# EAGLE design raspidolly (EAGLE 9.6.2)

## Sheet 1 of 2
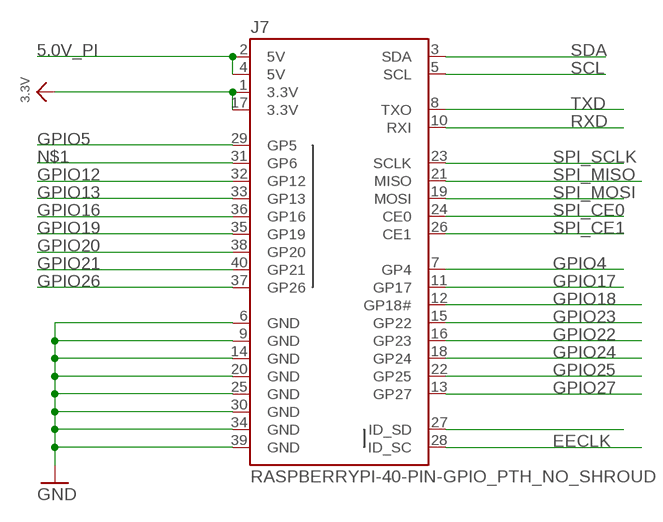
[diagram p0: schematic, sheet 1]

### Parts
J7  RASPBERRYPI-40-PIN-GPIO_PTH_NO_SHROUD  [2X20]

### Nets
3.3V: J7.1(3.3V) J7.17(3.3V) ; also sheet 2
5.0V_PI: J7.2(5V) J7.4(5V) ; also sheet 2
EECLK: J7.28(ID_SC)
EEDATA: J7.27(ID_SD)
GND: J7.6(GND) J7.9(GND) J7.14(GND) J7.20(GND) J7.25(GND) J7.30(GND) J7.34(GND) J7.39(GND) ; also sheet 2
GPIO4: J7.7(GP4) ; also sheet 2
GPIO5: J7.29(GP5)
GPIO12: J7.32(GP12) ; also sheet 2
GPIO13: J7.33(GP13) ; also sheet 2
GPIO16: J7.36(GP16) ; also sheet 2
GPIO17: J7.11(GP17) ; also sheet 2
GPIO18: J7.12(GP18#) ; also sheet 2
GPIO19: J7.35(GP19) ; also sheet 2
GPIO20: J7.38(GP20) ; also sheet 2
GPIO21: J7.40(GP21) ; also sheet 2
GPIO22: J7.15(GP22)
GPIO23: J7.16(GP23)
GPIO24: J7.18(GP24)
GPIO25: J7.22(GP25) ; also sheet 2
GPIO26: J7.37(GP26) ; also sheet 2
GPIO27: J7.13(GP27) ; also sheet 2
N$1: J7.31(GP6)
RXD: J7.10(RXI) ; also sheet 2
SCL: J7.5(SCL) ; also sheet 2
SDA: J7.3(SDA) ; also sheet 2
SPI_CE0: J7.24(CE0)
SPI_CE1: J7.26(CE1)
SPI_MISO: J7.21(MISO)
SPI_MOSI: J7.19(MOSI)
SPI_SCLK: J7.23(SCLK)
TXD: J7.8(TXO) ; also sheet 2

## Sheet 2 of 2: Systems
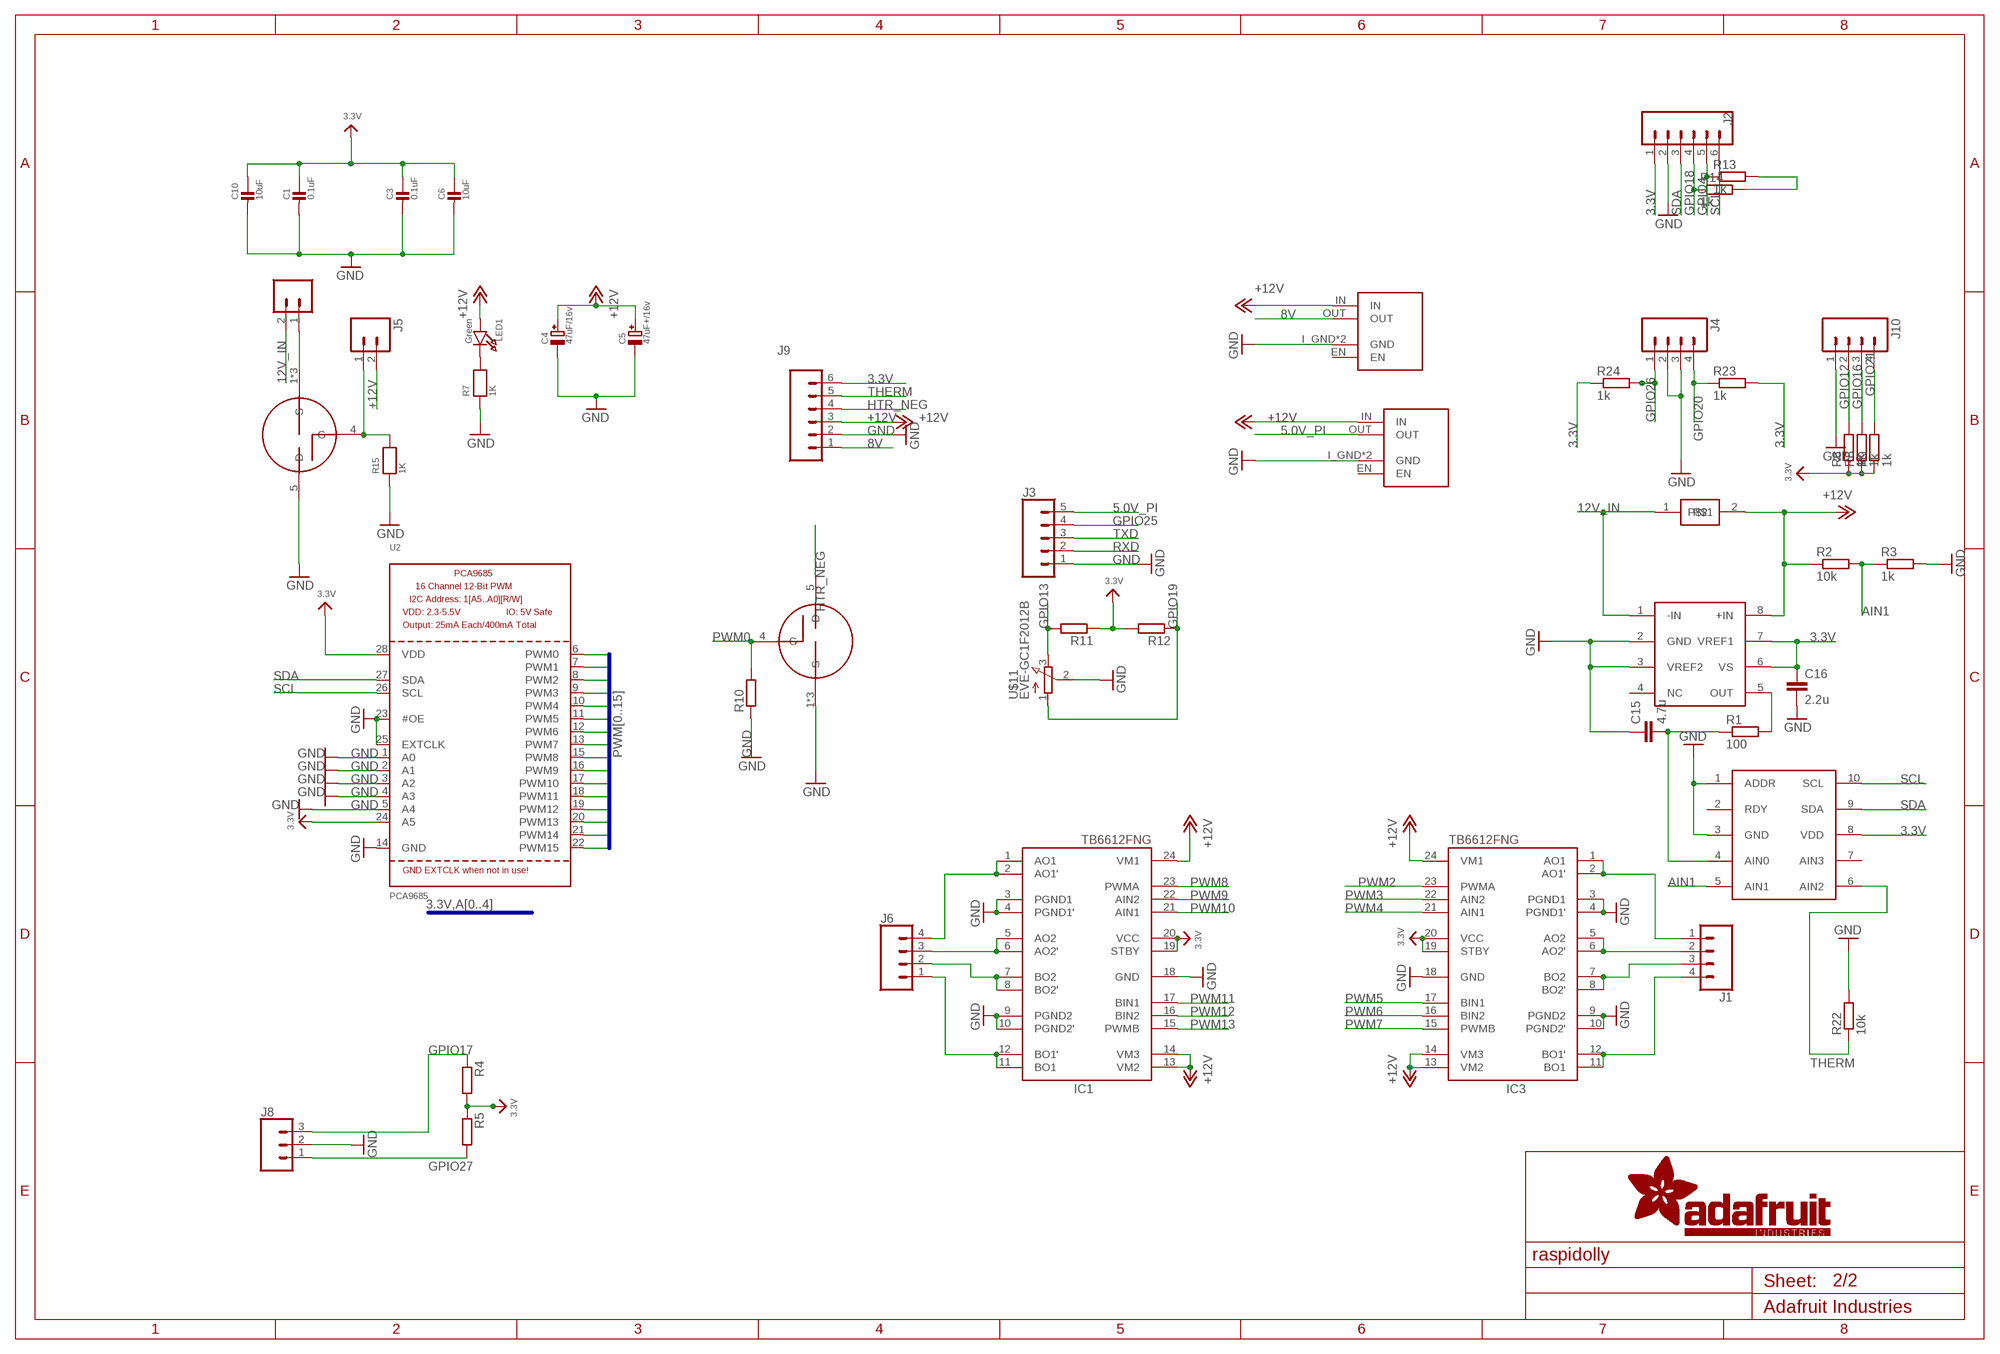
[diagram p1: schematic, sheet 2]

### Parts
C1  0.1uF  CAP_CERAMIC0805-NOOUTLINE  [0805-NO]
C3  0.1uF  CAP_CERAMIC0805-NOOUTLINE  [0805-NO]
C4  47uF/16v  CAP_ELECTROLYTICPANASONIC_C  [PANASONIC_C]
C5  47uF+/16v  CAP_ELECTROLYTICPANASONIC_C  [PANASONIC_C]
C6  10uF  CAP_CERAMIC0805-NOOUTLINE  [0805-NO]
C10  10uF  CAP_CERAMIC0805-NOOUTLINE  [0805-NO]
C15  4.7u  C-EUC0805  [C0805]
C16  2.2u  C-EUC0805  [C0805]
IC1  TB6612FNG  [SSOP24]
IC3  TB6612FNG  [SSOP24]
J1  CONN_04  [1X04]
J2  CONN_061.27MM  [1X06_1.27MM]
J3  CONN_051.27MM  [1X05_1.27MM]
J4  M04JST  [1X04-1.5MM_JST]
J5  M02PTH  [1X02]
J6  CONN_04  [1X04]
J8  CONN_03JST-PTH-VERT  [JST-3-PTH-VERT]
J9  CONN_061.27MM  [1X06_1.27MM]
J10  M04JST  [1X04-1.5MM_JST]
LED1  Green  LED0805_NOOUTLINE  [CHIPLED_0805_NOOUTLINE]
MPOWER  CONN_02  [1X02]
R1  100  R-EU_R0805  [R0805]
R2  10k  R-EU_R0805  [R0805]
R3  1k  R-EU_R0805  [R0805]
R4  R-EU_R0805  [R0805]
R5  R-EU_R0805  [R0805]
R6  1k  R-EU_R0805  [R0805]
R7  1K  RESISTOR0805_NOOUTLINE  [0805-NO]
R8  1k  R-EU_R0805  [R0805]
R9  1k  R-EU_R0805  [R0805]
R10  R-EU_R0805  [R0805]
R11  R-EU_R0805  [R0805]
R12  R-EU_R0805  [R0805]
R13  1k  R-EU_R0805  [R0805]
R14  1k  R-EU_R0805  [R0805]
R15  1K  RESISTOR0805_NOOUTLINE  [0805-NO]
R22  10k  R-EU_R0805  [R0805]
R23  1k  R-EU_R0805  [R0805]
R24  1k  R-EU_R0805  [R0805]
U2  PCA9685  [TSSOP28]
U$5  BUK9M  [LFPAK33]
U$6  BUK9M  [LFPAK33]
U$8  UFH-BUCK  [UFH-BUCK]
U$10  UFH-BUCK  [UFH-BUCK]
U$11  EVE-GC1F2012B  [EVE]
U$14  AD8418  [MSOP08]
U$15  ADS1015  [VSSOP10]
U$17  RESISTOR  [3921]

### Nets
3.3V: C1.1 C3.1 C6.1 C10.1 C16.1 IC1.19(STBY) IC1.20(VCC) IC3.19(STBY) IC3.20(VCC) J2.1 J9.6 R4.2 R5.1 R6.1 R8.1 R9.1 R11.1 R12.2 R13.2 R14.2 R23.2 R24.1 U2.24(A5) U2.28(VDD) U$14.6(VS) U$14.7(VREF1) U$15.8(VDD) ; also sheet 1
5.0V_PI: J3.5 U$10.OUT ; also sheet 1
8V: J9.1 U$8.OUT
12V_IN: MPOWER.2 U$14.1(-IN) U$17.1
+12V: C4.+ C5.+ IC1.13(VM2) IC1.14(VM3) IC1.24(VM1) IC3.13(VM2) IC3.14(VM3) IC3.24(VM1) J5.2 J9.3 LED1.A R2.1 U$8.IN U$10.IN U$14.8(+IN) U$17.2
AIN1: R2.2 R3.1 U$15.5(AIN1)
GND: C1.2 C3.2 C4.- C5.- C6.2 C10.2 C15.1 C16.2 IC1.3(PGND1) IC1.4(PGND1') IC1.9(PGND2) IC1.10(PGND2') IC1.18(GND) IC3.3(PGND1) IC3.4(PGND1') IC3.9(PGND2) IC3.10(PGND2') IC3.18(GND) J2.2 J3.1 J4.2 J4.3 J8.2 J9.2 J10.1 R3.2 R7.1 R10.1 R15.1 R22.2 U2.1(A0) U2.2(A1) U2.3(A2) U2.4(A3) U2.5(A4) U2.14(GND) U2.23(#OE) U2.25(EXTCLK) U$5.1(S) U$5.2(S) U$5.3(S) U$6.5(D) U$8.I_GND(GND) U$8.O_GND(GND) U$10.I_GND(GND) U$10.O_GND(GND) U$11.2(COM) U$14.2(GND) U$14.3(VREF2) U$15.1(ADDR) U$15.3(GND) ; also sheet 1
GPIO4: J2.5 R13.1 ; also sheet 1
GPIO12: J10.2 R6.2 ; also sheet 1
GPIO13: R11.2 U$11.3(B) ; also sheet 1
GPIO16: J10.3 R8.2 ; also sheet 1
GPIO17: J8.3 R4.1 ; also sheet 1
GPIO18: J2.4 R14.1 ; also sheet 1
GPIO19: R12.1 U$11.1(A) ; also sheet 1
GPIO20: J4.4 R23.1 ; also sheet 1
GPIO21: J10.4 R9.2 ; also sheet 1
GPIO25: J3.4 ; also sheet 1
GPIO26: J4.1 R24.2 ; also sheet 1
GPIO27: J8.1 R5.2 ; also sheet 1
HTR_NEG: J9.4 U$5.5(D)
N$3: MPOWER.1 U$6.1(S) U$6.2(S) U$6.3(S)
N$4: IC1.1(AO1) IC1.2(AO1') J6.4
N$6: IC1.5(AO2) IC1.6(AO2') J6.3
N$7: IC1.7(BO2) IC1.8(BO2') J6.2
N$9: IC1.11(BO1) IC1.12(BO1') J6.1
N$10: J5.1 R15.2 U$6.4(G)
N$12: IC3.1(AO1) IC3.2(AO1') J1.1
N$14: IC3.5(AO2) IC3.6(AO2') J1.2
N$15: IC3.7(BO2) IC3.8(BO2') J1.3
N$16: R1.2 U$14.5(OUT)
N$17: IC3.11(BO1) IC3.12(BO1') J1.4
N$20: C15.2 R1.1 U$15.4(AIN0)
N$133: LED1.C R7.2
PWM0: R10.2 U2.6(PWM0) U$5.4(G)
PWM1: U2.7(PWM1)
PWM2: IC3.23(PWMA) U2.8(PWM2)
PWM3: IC3.22(AIN2) U2.9(PWM3)
PWM4: IC3.21(AIN1) U2.10(PWM4)
PWM5: IC3.17(BIN1) U2.11(PWM5)
PWM6: IC3.16(BIN2) U2.12(PWM6)
PWM7: IC3.15(PWMB) U2.13(PWM7)
PWM8: IC1.23(PWMA) U2.15(PWM8)
PWM9: IC1.22(AIN2) U2.16(PWM9)
PWM10: IC1.21(AIN1) U2.17(PWM10)
PWM11: IC1.17(BIN1) U2.18(PWM11)
PWM12: IC1.16(BIN2) U2.19(PWM12)
PWM13: IC1.15(PWMB) U2.20(PWM13)
PWM14: U2.21(PWM14)
PWM15: U2.22(PWM15)
RXD: J3.2 ; also sheet 1
SCL: J2.6 U2.26(SCL) U$15.10(SCL) ; also sheet 1
SDA: J2.3 U2.27(SDA) U$15.9(SDA) ; also sheet 1
THERM: J9.5 R22.1 U$15.6(AIN2)
TXD: J3.3 ; also sheet 1
Unconnected: U$8.EN U$10.EN U$14.4(NC) U$15.2(RDY) U$15.7(AIN3)

### Buses
PWM[0..15]
3.3V,A[0..4]

## Library data of the parts
C1 C3 C6 C10 = microbuilder:CAP_CERAMIC: Ceramic Capacitors For new designs, use the packages preceded by an '_' character since they are more reliable: The following footprints should be used on most boards: _0402 - Standard footprint for regular board layouts _0603 - Standard footprint for regular board layouts _0805 - Standard footprint for regular board layouts For extremely tight-pitch boards where space is at a premium, the following 'micro-pitch' footprints can be used (smaller pads, no silkscreen outline, etc.): _0402MP - Micro-pitch footprint for very dense/compact boards _0603MP - Micro-pitch footprint for very dense/compact boards _0805MP - Micro-pitch footprint for very dense/compact boards Commonly Stocked Parts 0402 - 0402 Surface Mount Capacitors 16pF 50V 5% [Digikey: 445-4899-2-ND] 18pF 50V 5% [Digikey: 490-1281-2-ND] 22pF 50V 5% [Digikey: 490-1283-2-ND] 68pF 50V 5% [Digikey: 490-1289-2-ND] 0.1uF 10V 10% [Digikey: 490-1318-2-ND] 1.0uF 6.3V 10% [Digikey: 490-1320-2-ND] 0603 - 0603 Surface Mount Capacitors 16 pF 50V 5% [Digikey: 445-5051-2-ND] 22 pF 50V [Digikey: PCC220ACVTR-ND] 33 pF 50V 5% [Digikey: 490-1415-1-ND] 56pF 50V 5% [Digikey: 490-1421-1-ND] 220pF 50V 5% [Digikey: 445-1285-1-ND] 680 pF 50V 2200 pF 50V 5% C0G [Digikey: 445-1297-1-ND] 5600 pF 100V 5% X7R [Digikey: 478-3711-1-ND] 0.1 µF 25V 10% [Digikey: PCC2277TR-ND] 0.22 µF 16V 10% X7R [Digikey: 445-1318-1-ND] 1.0 µF 25V 10% [Digikey: 445-5146-2-ND] 0603 - RF Specific 3pF 250V +/-0.1pF RF [Digikey: 712-1347-1-ND] 18 pF 250V 5% [Digikey: 478-3505-1-ND or 712-1322-1-ND] 56 pF 250V 5% C0G RF [Digikey: 490-4867-1-ND] 68 pF 250V RF [Digikey: 490-4868-1-ND] 0805 - 0805 Surface Mount Capacitors 220 pF 250V 2% RF Ceramic Capacitor [Digikey: 712-1398-1-ND] 1000 pF 50V 2% NP0 Ceramic Capacitor [Digikey: 478-3760-1-ND] 0.1 µF 25V 10% Ceramic Capacitor [Digikey: PCC1828TR-ND] 1.0 µF 16V 10% Ceramic Capacitor[Digikey: 490-1691-2-ND] 10.0 µF 10V 10% Ceramic Capacitor[Digikey: 709-1228-1-ND] 10.0 uF 16V 10% Ceramic Capacitor [Digikey: 478-5165-2-ND] 47 uF 6.3V 20% Ceramic Capacitor [Digikey: 587-1779-1-ND or 399-5506-1-ND] 1206 - 1206 Surface Mount Capacitors 47uF 10V 20% Ceramic Capacitor [Digikey: 490-5528-1-ND or 399-5508-1-ND or 445-6010-1-ND] 100uF 6.3V -20%, +80% Y5V Ceramic Capacitor (Digikey: 490-4512-1-ND, Mouser: 81-GRM31CF50J107ZE1L)
C4 C5 = microbuilder:CAP_ELECTROLYTIC: Electrolytic Capacitors SMT PANASONIC_C - Size C Panasonic Electrolytic Aluminum Capacitor 47µF 16V 20% Electrolytic Capacitor [Digikey: PCE3890TR-ND] PANASONIC_D - Size D Panasonic Electrolytic Aluminum Capacitor 100µF 25V 20% Electrolytic Capacitor [Digikey: PCE3898TR-ND] PTH 3.5 mm grid, 8 mm diameter ... 3.5 mm grid, 10 mm diameter ...
C15 C16 = rcl:C-EU: CAPACITOR, European symbol; SPICEPREFIX: C
IC1 IC3 = adafruit:TB6612FNG: TB6612FNG MOS dual H-bridge motor driver, 1.2A current 3.2A peak 3 or 5v logic and 3-15v motor
J1 J6 = SparkFun-Connectors:CONN_04: Multi connection point. Often used as Generic Header-pin footprint for 0.1 inch spaced/style header connections On any of the 0.1 inch spaced packages, you can populate with these: Break Away Headers - Straight <https://www.sparkfun.com/products/116> (PRT-00116) Break Away Male Headers - Right Angle <https://www.sparkfun.com/products/553> (PRT-00553) Female Headers <https://www.sparkfun.com/products/115> (PRT-00115) Break Away Headers - Machine Pin <https://www.sparkfun.com/products/117> (PRT-00117) Break Away Female Headers - Swiss Machine Pin <https://www.sparkfun.com/products/743> (PRT-00743) For SCREWTERMINALS and SPRING TERMINALS visit here: Screw Terimnals on SparkFun.com <https://www.sparkfun.com/search/results?term=Screw+Terminals> (5mm/3.5mm/2.54mm spacing) This device is also useful as a general connection point to wire up your design to another part of your project. Our various solder wires solder well into these plated through hole pads. Hook-Up Wire - Assortment (Stranded, 22 AWG) <https://www.sparkfun.com/products/11375> (PRT-11375) Hook-Up Wire - Assortment (Solid Core, 22 AWG) <https://www.sparkfun.com/products/11367> (PRT-11367) View the entire wire category on our website here <https://www.sparkfun.com/categories/141> Special notes: Molex polarized connector foot print use with SKU : PRT-08231 with associated crimp pins and housings. 1MM SMD Version SKU: PRT-10208; PROD_ID: CONN-09696
J2 J9 = SparkFun-Connectors:CONN_06: Multi connection point. Often used as Generic Header-pin footprint for 0.1 inch spaced/style header connections On any of the 0.1 inch spaced packages, you can populate with these: Break Away Headers - Straight <https://www.sparkfun.com/products/116> (PRT-00116) Break Away Male Headers - Right Angle <https://www.sparkfun.com/products/553> (PRT-00553) Female Headers <https://www.sparkfun.com/products/115> (PRT-00115) Break Away Headers - Machine Pin <https://www.sparkfun.com/products/117> (PRT-00117) Break Away Female Headers - Swiss Machine Pin <https://www.sparkfun.com/products/743> (PRT-00743) Arduino Stackable Header - 6 Pin <https://www.sparkfun.com/products/9280> (PRT-09280) For SCREWTERMINALS and SPRING TERMINALS visit here: Screw Terimnals on SparkFun.com <https://www.sparkfun.com/search/results?term=Screw+Terminals> (5mm/3.5mm/2.54mm spacing) This device is also useful as a general connection point to wire up your design to another part of your project. Our various solder wires solder well into these plated through hole pads. Hook-Up Wire - Assortment (Stranded, 22 AWG) <https://www.sparkfun.com/products/11375> (PRT-11375) Hook-Up Wire - Assortment (Solid Core, 22 AWG) <https://www.sparkfun.com/products/11367> (PRT-11367) View the entire wire category on our website here <https://www.sparkfun.com/categories/141>
J3 = SparkFun-Connectors:CONN_05: Multi connection point. Often used as Generic Header-pin footprint for 0.1 inch spaced/style header connections On any of the 0.1 inch spaced packages, you can populate with these: Break Away Headers - Straight <https://www.sparkfun.com/products/116> (PRT-00116) Break Away Male Headers - Right Angle <https://www.sparkfun.com/products/553> (PRT-00553) Female Headers <https://www.sparkfun.com/products/115> (PRT-00115) Break Away Headers - Machine Pin <https://www.sparkfun.com/products/117> (PRT-00117) Break Away Female Headers - Swiss Machine Pin <https://www.sparkfun.com/products/743> (PRT-00743) For SCREWTERMINALS and SPRING TERMINALS visit here: Screw Terimnals on SparkFun.com <https://www.sparkfun.com/search/results?term=Screw+Terminals> (5mm/3.5mm/2.54mm spacing) This device is also useful as a general connection point to wire up your design to another part of your project. Our various solder wires solder well into these plated through hole pads. Hook-Up Wire - Assortment (Stranded, 22 AWG) <https://www.sparkfun.com/products/11375> (PRT-11375) Hook-Up Wire - Assortment (Solid Core, 22 AWG) <https://www.sparkfun.com/products/11367> (PRT-11367) View the entire wire category on our website here <https://www.sparkfun.com/categories/141> Special notes: Molex polarized connector foot print use with SKU : PRT-08231 with associated crimp pins and housings. 1MM SMD Version SKU: PRT-10208
J4 J10 = SparkFun-Connectors:M04: Header 4 Standard 4-pin 0.1" header. Use with straight break away headers (SKU : PRT-00116), right angle break away headers (PRT-00553), swiss pins (PRT-00743), machine pins (PRT-00117), and female headers (PRT-00115). Molex polarized connector foot print use with SKU : PRT-08231 with associated crimp pins and housings. 1MM SMD Version SKU: PRT-10208; PROD_ID: CONN-12477
J5 = SparkFun-Connectors:M02: Standard 2-pin 0.1" header. Use with - straight break away headers ( PRT-00116) - right angle break away headers (PRT-00553) - swiss pins (PRT-00743) - machine pins (PRT-00117) - female headers (PRT-00115) Molex polarized connector foot print use with: PRT-08233 with associated crimp pins and housings. 2.54_SCREWTERM for use with PRT-10571. 3.5mm Screw Terminal footprints for PRT-08084 5mm Screw Terminal footprints for use with PRT-08432
J7 = SparkFun-Connectors:RASPBERRYPI-40-PIN-GPIO: Raspberry Pi GPIO Header 2x20 pin connector, as found on B, B+, A+ models. Both shrouded PTH and SMT versions available. SparkFun Products: GPIO Shrouded Header <https://www.sparkfun.com/products/13054>- PTH SparkFun Pi Wedge (Preassembled) <https://www.sparkfun.com/products/13717>
J8 = SparkFun-Connectors:CONN_03: Multi connection point. Often used as Generic Header-pin footprint for 0.1 inch spaced/style header connections On any of the 0.1 inch spaced packages, you can populate with these: Break Away Headers - Straight <https://www.sparkfun.com/products/116> (PRT-00116) Break Away Male Headers - Right Angle <https://www.sparkfun.com/products/553> (PRT-00553) Female Headers <https://www.sparkfun.com/products/115> (PRT-00115) Break Away Headers - Machine Pin <https://www.sparkfun.com/products/117> (PRT-00117) Break Away Female Headers - Swiss Machine Pin <https://www.sparkfun.com/products/743> (PRT-00743) Stackable Header - 3 Pin (Female, 0.1") <https://www.sparkfun.com/products/13875> (PRT-13875) For SCREWTERMINALS and SPRING TERMINALS visit here: Screw Terimnals on SparkFun.com <https://www.sparkfun.com/search/results?term=Screw+Terminals> (5mm/3.5mm/2.54mm spacing) This device is also useful as a general connection point to wire up your design to another part of your project. Our various solder wires solder well into these plated through hole pads. Hook-Up Wire - Assortment (Stranded, 22 AWG) <https://www.sparkfun.com/products/11375> (PRT-11375) Hook-Up Wire - Assortment (Solid Core, 22 AWG) <https://www.sparkfun.com/products/11367> (PRT-11367) View the entire wire category on our website here <https://www.sparkfun.com/categories/141> Special notes: Molex polarized connector foot print use with SKU : PRT-08232 with associated crimp pins and housings.; PROD_ID: CONN-13230
LED1 = microbuilder:LED: LED 0603 - 0603 Surface Mount Package 2mA: Green LED - Low Power (3.9mcd, 2ma, 1.7Vf) - Digikey: 475-2709-2-ND Orange LED - Low Power (9.8mcd, 2ma, 1.8Vf) - Digikey: 475-1194-2-ND Red LED - Low Power (5mcd, 2ma, 1.8Vf) - Digikey: 475-1195-2-ND Yellow LED - Low Power (7mcd, 2ma, 1.8Vf) - Digikey: 475-1196-2-ND 5mA: Blue LED - Low Power (17mcd, 5ma, 2.9Vf) - Digikey: LNJ937W8CRACT-ND 0805 - 0805 Surface Mount Package 2mA: Red LED (8.8mcd, 2mA, 1.8Vf, Clear) - Low Power [Digikey: 475-2510-1-ND] Green LED (5mcd, 2mA, 1.8Vf, Clear) - Low Power [Digikey: 475-2730-1-ND] Yellow LED (11.3mcd, 2mA, 1.8Vf, Clear) - Low Power [Digikey: 475-2555-1-ND] 20mA: Red LED (104mcd, 20mA, Diffused) - LS R976 [Digikey: 475-1278-6-ND] Red LED (12mcd, 20mA, 2.0Vf, Clear) - APT2012EC [Digikey: 754-1128-1-ND] Green LED (15mcd, 20mA, 2.2Vf, Clear) - APT2012GC [Digikey: 754-1131-1-ND] Orange LED (160mcd, 20mA, 2.1Vf, Clear) - APT2012SECK [Digikey: 754-1130-1-ND] 1206 - 1206 Surface Mount Package Green LED (26mcd, 20mA, Diffused) - LG N971 [Digikey: 475-1407-6-ND] Red LED (15mcd, 20mA, Diffused) - LH N974 [Digikey: 475-1416-6-ND] Cree - Cree High-Power Surface Mount LEDs XPEBWT-L1-0000-00D50 - White 111lm 350mA 2.9Vf 6200K 110° XTEAWT-00-0000-00000LEE3 - White 114lm 350mA 2.85Vf 5000K 115° Everlight - Everlight 45-21 Series Surface Mount LEDs 45-21/QK2C-B2832AC2CB2/2T - Warm White 2000mcd 20mA 3.25Vf 3050K 120° 45-21/LK2C-B38452C4CB2/2T - Nuetral White 2000mcd 20mA 3.25Vf 4150K 120° 45-21/LK2C-B50634C6CB2/2T - Cold White 2200mcd 20mA 3.25Vf 5650K 120° PLCC2 Reverse Mount LS T77K-J1L2-1-0-2-R18-Z - Red 11.25mcd 2mA 1.8Vf 630nm 120° LO T77K-L1M2-24-Z - Orange 19.6mcd 2mA 1.8Vf 606nm 120° LY T77K-K2M1-26-Z - Yellow 15.7mcd 2mA 1.8Vf 587nm 120°
MPOWER = SparkFun-Connectors:CONN_02: Multi connection point. Often used as Generic Header-pin footprint for 0.1 inch spaced/style header connections On any of the 0.1 inch spaced packages, you can populate with these: Break Away Headers - Straight <https://www.sparkfun.com/products/116> (PRT-00116) Break Away Male Headers - Right Angle <https://www.sparkfun.com/products/553> (PRT-00553) Female Headers <https://www.sparkfun.com/products/115> (PRT-00115) Break Away Headers - Machine Pin <https://www.sparkfun.com/products/117> (PRT-00117) Break Away Female Headers - Swiss Machine Pin <https://www.sparkfun.com/products/743> (PRT-00743) For SCREWTERMINALS and SPRING TERMINALS visit here: Screw Terimnals on SparkFun.com <https://www.sparkfun.com/search/results?term=Screw+Terminals> (5mm/3.5mm/2.54mm spacing) This device is also useful as a general connection point to wire up your design to another part of your project. Our various solder wires solder well into these plated through hole pads. Hook-Up Wire - Assortment (Stranded, 22 AWG) <https://www.sparkfun.com/products/11375> (PRT-11375) Hook-Up Wire - Assortment (Solid Core, 22 AWG) <https://www.sparkfun.com/products/11367> (PRT-11367) View the entire wire category on our website here <https://www.sparkfun.com/categories/141> Special notes: Molex polarized connector foot print use with: PRT-08233 with associated crimp pins and housings. 2.54_SCREWTERM for use with PRT-10571. 3.5mm Screw Terminal footprints for PRT-08084 5mm Screw Terminal footprints for use with PRT-08432
R1-R3 R6 R8 R9 R13 R14 R22-R24 = rcl:R-EU_: RESISTOR, European symbol; SPICEPREFIX: R
R4 R5 R10-R12 = resistor:R-EU_: RESISTOR, European symbol
R7 R15 = microbuilder:RESISTOR: Resistors For new designs, use the packages preceded by an '_' character since they are more reliable: The following footprints should be used on most boards: _0402 - Standard footprint for regular board layouts _0603 - Standard footprint for regular board layouts _0805 - Standard footprint for regular board layouts For extremely tight-pitch boards where space is at a premium, the following 'micro-pitch' footprints can be used (smaller pads, no silkscreen outline, etc.): _0402MP - Micro-pitch footprint for very dense/compact boards _0603MP - Micro-pitch footprint for very dense/compact boards _0805MP - Micro-pitch footprint for very dense/compact boards
U2 = microbuilder:PCA9685: PCA9685 - 16 Channel 12-Bit I2C PWM Controller 5.0V tolerant 16 channel, 12-bit I2C PWM controller with 25mA per output (max. 400mA total) Digikey: 568-5931-1-ND
U$5 U$6 = abysscore:BUK9M
U$8 U$10 = abysscore:UFH-BUCK
U$11 = abysscore:EVE-GC1F2012B
U$14 = abysscore:AD8418
U$15 = abysscore:ADS1015
U$17 = abysscore:RESISTOR

## Board
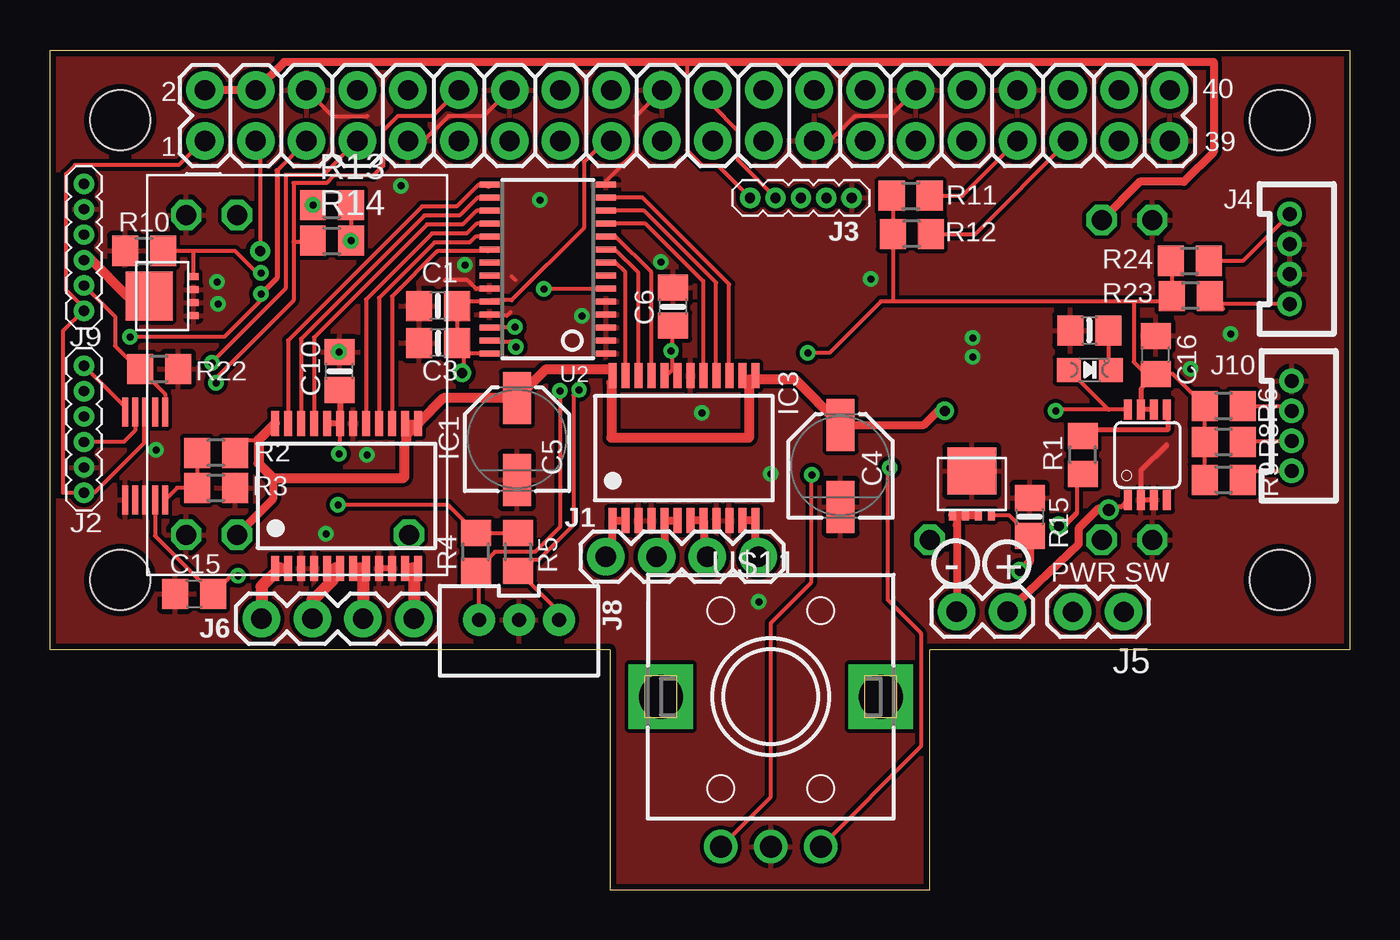
[diagram p2: board, top side]
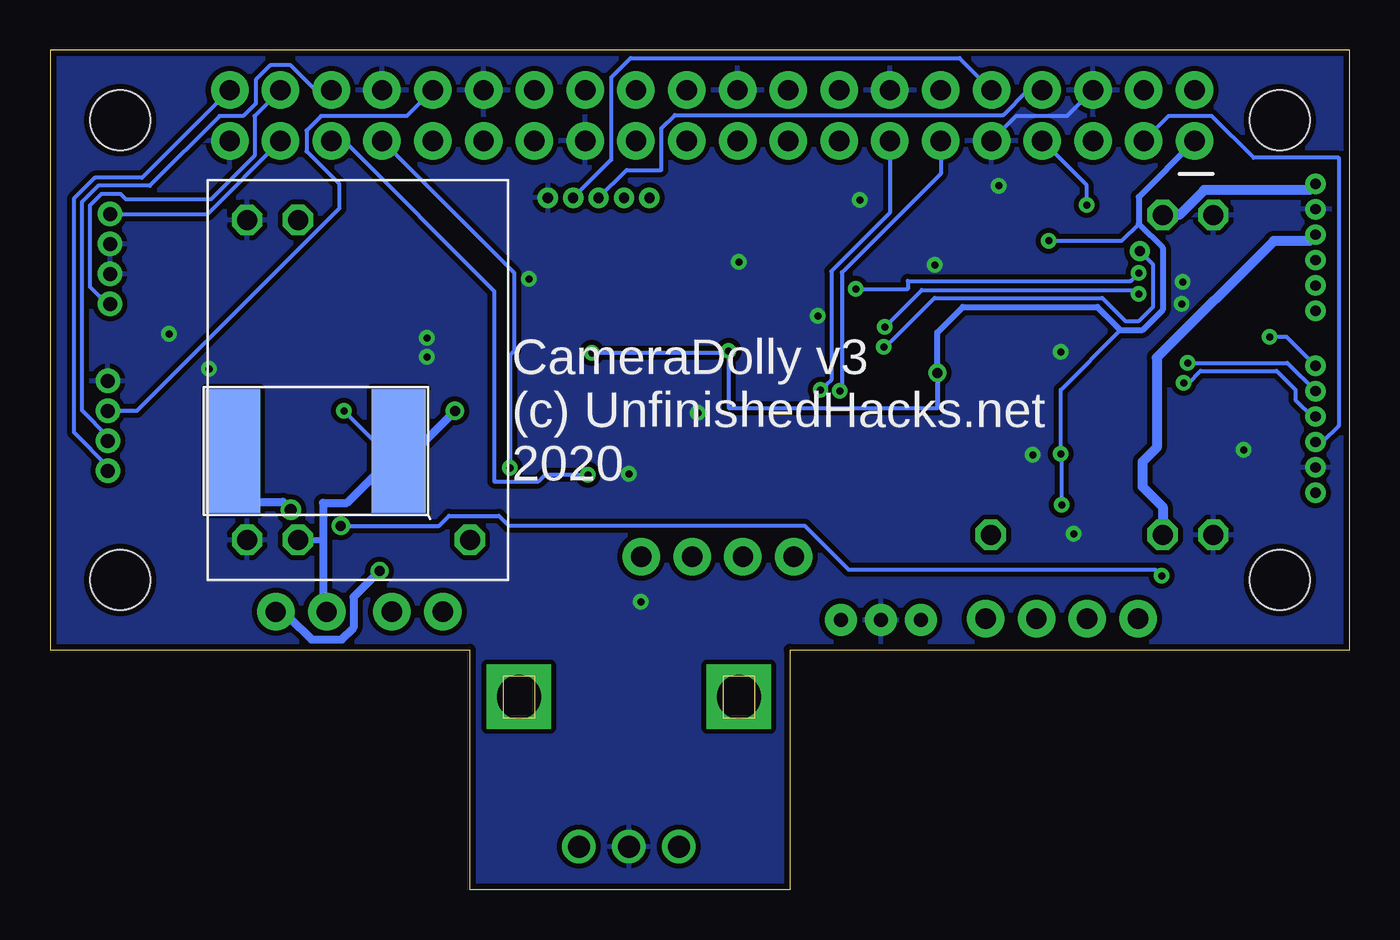
[diagram p3: board, bottom side, seen from below]

Size 65 x 42 mm. Coordinates in mm from the lower left corner, seen from the top.
Outline: 0,42 65,42 65,12 44,12 44,0 28,0 28,12 0,12 0,42
Copper layers (1*16): Top 0.035mm / dielectric 1.5mm / Bottom 0.035mm
Design rules "adafruit *": minimum track width 0.2mm, minimum drill 0.3mm, track to track 8mil, track to pad 0.2mm, pad to pad 0.2mm, via to via 8mil, smd to smd 0.2mm, copper to edge 0.3mm, drill to drill 0.3mm, minimum pad ring 10mil, minimum via ring 8mil, stop-mask expansion 2mil, vias tented up to drill 20mil, thermal gap 10mil
Holes 3 mm at 3.5,15.5 61.5,15.5 61.5,38.5 3.5,38.5

### Footprints (pad centres in the part's own frame; a part is rotated, then mirrored left to right if it is on the bottom)
0805-NO = smd 1.3 x 1.5: 1 -0.95,0; 2 0.95,0
PANASONIC_C = smd 2.6 x 1.4: + 2.05,0; - -2.05,0
C0805 = smd 1.3 x 1.5: 1 -0.95,0; 2 0.95,0
SSOP24 = smd 0.4 x 1.25: 1 -3.575,-3.625; 2 -2.925,-3.625; 3 -2.275,-3.625; 4 -1.625,-3.625; 5 -0.975,-3.625; 6 -0.325,-3.625; 7 0.325,-3.625; 8 0.975,-3.625; 9 1.625,-3.625; 10 2.275,-3.625; 11 2.925,-3.625; 12 3.575,-3.625; 13 3.575,3.625; 14 2.925,3.625; 15 2.275,3.625; 16 1.625,3.625; 17 0.975,3.625; 18 0.325,3.625; 19 -0.325,3.625; 20 -0.975,3.625; 21 -1.625,3.625; 22 -2.275,3.625; 23 -2.925,3.625; 24 -3.575,3.625
1X04 = drill 1.016 pad 1.88: 1 0,0; 2 2.54,0; 3 5.08,0; 4 7.62,0
1X06_1.27MM = drill 0.508 pad 1: 1 0,0; 2 1.27,0; 3 2.54,0; 4 3.81,0; 5 5.08,0; 6 6.35,0
1X05_1.27MM = drill 0.508 pad 1: 1 0,0; 2 1.27,0; 3 2.54,0; 4 3.81,0; 5 5.08,0
1X04-1.5MM_JST = drill 0.7: 1 0,0; 2 1.5,0; 3 3,0; 4 4.5,0
1X02 = drill 1 pad 1.88: 1 0,0; 2 2.54,0
2X20 = drill 1.016 pad 1.88: 1 0,0; 2 0,2.54; 3 2.54,0; 4 2.54,2.54; 5 5.08,0; 6 5.08,2.54; 7 7.62,0; 8 7.62,2.54; 9 10.16,0; 10 10.16,2.54; 11 12.7,0; 12 12.7,2.54; 13 15.24,0; 14 15.24,2.54; 15 17.78,0; 16 17.78,2.54; 17 20.32,0; 18 20.32,2.54; 19 22.86,0; 20 22.86,2.54; 21 25.4,0; 22 25.4,2.54; 23 27.94,0; 24 27.94,2.54; 25 30.48,0; 26 30.48,2.54; 27 33.02,0; 28 33.02,2.54; 29 35.56,0; 30 35.56,2.54; 31 38.1,0; 32 38.1,2.54; 33 40.64,0; 34 40.64,2.54; 35 43.18,0; 36 43.18,2.54; 37 45.72,0; 38 45.72,2.54; 39 48.26,0; 40 48.26,2.54
JST-3-PTH-VERT = drill 0.7 pad 1.6: 1 -2,-0.55; 2 0,-0.55; 3 2,-0.55
CHIPLED_0805_NOOUTLINE = smd 1.2 x 1.2: A 0,-1.05; C 0,1.05
1X02' = drill 1.016 pad 1.88: 1 0,0; 2 2.54,0
R0805 = smd 1.3 x 1.5: 1 -0.95,0; 2 0.95,0
TSSOP28 = smd 0.305 x 0.991: 1 -4.225,-2.918; 2 -3.575,-2.918; 3 -2.925,-2.918; 4 -2.275,-2.918; 5 -1.625,-2.918; 6 -0.975,-2.918; 7 -0.325,-2.918; 8 0.325,-2.918; 9 0.975,-2.918; 10 1.625,-2.918; 11 2.275,-2.918; 12 2.925,-2.918; 13 3.575,-2.918; 14 4.225,-2.918; 15 4.225,2.918; 16 3.575,2.918; 17 2.925,2.918; 18 2.275,2.918; 19 1.625,2.918; 20 0.975,2.918; 21 0.325,2.918; 22 -0.325,2.918; 23 -0.975,2.918; 24 -1.625,2.918; 25 -2.275,2.918; 26 -2.925,2.918; 27 -3.575,2.918; 28 -4.225,2.918
LFPAK33 = smd 0.35 x 0.5: 1 -0.975,-0.775; 2 -0.325,-0.775; 3 0.325,-0.775; 4 0.975,-0.775 | smd 2.45 x 2.35: 5 0,1.45
UFH-BUCK = drill 1 octagon: EN 18,13.1; I_GND 18,1.96; IN 18,4.5; O_GND 2,1.96; OUT 2,4.5
EVE = drill 1.1 pad 1.676: 1 -2.5,-7.5; 2 0,-7.5; 3 2.5,-7.5 | drill 2.2 pad 2.8 square: M1 5.5,0; M2 -5.5,0
MSOP08 = smd 0.4 x 1: 1 -0.976,-2.263; 2 -0.326,-2.263; 3 0.324,-2.263; 4 0.974,-2.263; 5 0.974,2.262; 6 0.324,2.262; 7 -0.326,2.262; 8 -0.976,2.262
VSSOP10 = smd 1.45 x 0.3: 1 -2.2,1; 2 -2.2,0.5; 3 -2.2,0; 4 -2.2,-0.5; 5 -2.2,-1; 6 2.2,-1; 7 2.2,-0.5; 8 2.2,0; 9 2.2,0.5; 10 2.2,1
3921 = smd 2.7 x 6.2: 1 -4.15,0; 2 4.15,0

### Placement (x,y rotation side)
C1  19.41,29.2 180 top
C3  19.42,27.34 180 top
C4  39.55,21.2 90 top
C5  23.36,22.53 90 top
C6  31.17,29.15 90 top
C10  14.48,25.93 90 top
C15  7.2,14.8 0 top
C16  55.3,26.75 90 top
IC1  14.84,19.7 0 top
IC3  31.7,22.08 0 top
J1  27.8,16.65 0 top
J2  1.7,19.85 90 top
J3  40.1,34.6 180 top
J4  62,33.8 270 top
J5  53.7,13.9 180 top
J6  18.2,13.55 180 top
J7  7.75,37.45 0 top
J8  23.45,12.95 180 top
J9  1.7,35.3 270 top
J10  62.1,25.45 270 top
LED1  52,26 270 top
MPOWER  [1X02']  45.35,13.9 0 top
R1  51.65,21.75 90 top
R2  8.3,21.85 180 top
R3  8.3,20.1 0 top
R4  21.3,16.9 90 top
R5  23.4,16.9 270 top
R6  58.7,24.2 0 top
R7  51.99,27.97 0 top
R8  58.7,22.4 0 top
R9  58.7,20.5 0 top
R10  4.7,31.95 0 top
R11  43.05,34.7 0 top
R12  43.1,32.8 180 top
R13  14.1,34.25 0 top
R14  14.1,32.45 0 top
R15  49,18.65 270 top
R22  5.45,26.05 0 top
R23  57.05,29.7 180 top
R24  57,31.45 0 top
U2  24.9,31.04 90 top
U$5  6.4,29.7 90 top
U$6  46.1,19.5 0 top
U$8  4.85,35.75 270 top
U$10  57.1,35.5 270 bottom
U$11  36.05,9.65 0 top
U$14  54.9,21.75 0 top
U$15  4.75,21.7 90 top
U$17  51.7,21.95 0 bottom

### Tracks (layer width: path | path; a pad name or v marks a point on that pad's centre or on a via)
3.3V  (via drill 0.35, 0.5)
  Top 0.2: C3.1 20.36,27.36 C1.1 20.57,29.41 U2.24 22.06,29.48 23.09,29.48 26.7,33.09 26.7,36.4 27.75,37.45 J7.17 | U2.28 20.9,26.81 C3.1 | C3.1 20.69,27.02 20.69,25.93 v20.62,25.85 | 31.12,26 31.12,26.88 v31.06,26.95 31.13,27.02 31.13,28.16 C6.1 | J7.1 7.64,37.45 6.44,36.25 1.25,36.25 0.8,35.8 0.8,29.98 1.7,29.08 1.7,29 | 54.2,29.42 54.2,26.4 54.8,25.8 C16.1 | 54.57,25.05 54.7,25.18 54.7,25.2 C16.1 | R24.1 56.1,31.4 R23.2 56.1,29.42 54.2,29.42 | 54.2,29.42 42.1,29.42 | 42.1,29.42 41.55,29.42 38.98,26.85 v37.9,26.85 | R11.1 42.15,34.65 R12.2 42.15,29.47 42.1,29.42 | J9.6 1.7,29 | 1.7,29 0.65,27.95 0.65,19.85 J2.1 2.22,19.85 4.7,22.33 4.7,23.85 U$15.8 | IC3.20 30.82,25.7 31.12,26 | IC3.19 31.38,25.75 31.12,26 | C10.1 14.48,21.78 14.45,21.75 v14.45,21.8 | R5.1 R4.2 19.9,19.25 v14.4,19.25 | R9.1 R8.1 R6.1 56.15,25.8 C16.1 | R13.2 R14.2
  Top 0.25: 54.57,25.05 U$14.7 U$14.6 | C16.1 54.85,25.35
  Top 0.3: IC1.19 IC1.20
  Top 0.305: C10.1 14.51,24.95 IC1.19
  Bottom 0.2: 20.62,24.09 31.06,24.09 v31.06,26.95 31.16,26.85 v37.9,26.85 | 11.45,27.99 14.45,24.99 v14.45,21.8 14.4,21.75 v14.4,19.25 | R14.2 11.4,32.45 10.55,33.3
  Bottom 0.25: v20.62,25.85 20.62,24.09
  Bottom 0.3: J7.1 10.55,34.65 10.55,33.3 9.35,32.1 9.35,28.99 10.35,27.99 11.45,27.99 12.6,29.14 19.35,29.14 20.62,27.87 v20.62,25.85 20.64,25.85 20.65,25.84
  other vias: 15.05,32.45
5.0V_PI
  Top 0.2: J3.5 33.41,36.21 32.64,36.21 31.85,37 31.85,41.4
  Top 0.4: U$10.OUT 54.51,35.41 56.72,35.41 58.2,36.9 58.2,41.4 31.85,41.4 11.7,41.4 J7.4 J7.2
8V
  Bottom 0.5: J9.1 2.01,34.99 7.28,34.99 8.51,33.75 U$8.OUT
12V_IN  (via drill 0.6)
  Top 0.25: U$14.1 53.59,19.15 52.95,19.15 v52.95,19
  Top 0.3: 52.95,19.15 52.95,19.05
  Top 0.4: MPOWER.2 51.45,17.27 51.45,18.06 52.44,19.05 52.95,19.05
  Bottom 0.25: 55.85,20.25 55.35,19.75 55.35,19.4
  Bottom 0.4: 55.35,19.4 53.35,19.4 v52.95,19
  Bottom 1: U$17.1 55.85,20.25
+12V  (via drill 0.35, 0.5)
  Top 0.2: 52.94,24.01 LED1.A | U$14.8 52.94,24.01 | 52.94,24.01 50.36,24.01 v50.3,23.95 | R2.1 9.9,22.5 10.44,22.5 | IC3.14 34.75,25.7 34.95,25.5 35.08,25.5 IC3.13 | 28.02,26 28.12,25.9 IC3.24 28.07,25.65 28.07,25.35
  Top 0.25: U$14.8
  Top 0.4: U$8.IN 11.15,19.55 11.15,20.6 | IC1.14 IC1.13 | v44.75,23.95 44.4,23.95 43.7,23.25 C4.+
  Top 0.5: IC1.24 10.44,22.5 10.44,21.31 11.15,20.6 17.7,20.6 17.7,22.25 17.81,22.36 17.81,22.73 IC1.13 19.66,24.58 C5.+ 24.79,26 28.02,26 | 28.07,25.35 28.07,22.6 34.95,22.6 34.95,25.5 37.3,25.5 C4.+
  Top 0.61: C5.+ 23.36,24.43
  Top 1: C5.+ 23.36,24.54
  Bottom 0.2: v50.3,23.95 48.3,21.95 U$17.2
  Bottom 0.3: U$10.IN 51.45,17.5 51.35,17.4
  Bottom 0.4: J5.2 51.35,13.84 51.35,17.4 51.35,19.35 50.15,19.35 U$17.2 46.75,21.95 v44.75,23.95
  Bottom 0.5: J9.3 2.01,32.45 3.8,32.45 9.64,26.6 9.64,22.11 10.36,21.4 10.36,20.15 9.35,19.15 U$8.IN
AIN1
  Top 0.2: R2.2 R3.1 6.35,20.1 U$15.5
GND  (via drill 0.35)
  Top 0.2: 19.74,30.48 20.9,30.48 21.32,30.06 U2.23 | 23.28,30.49 23.1,30.66 | 23.03,28.89 22.85,28.71 22.04,28.71 U2.25 | J7.14 21.69,38.69 19.94,38.69 18.7,37.45 J7.9 | J7.6 14.13,38.69 15.88,38.69 | J7.20 29.31,38.69 29.31,36.94 27.82,35.44 U2.14 | J7.30 42.01,38.69 40.26,38.69 39.02,37.45 J7.25
  Top 0.25: 55.85,22.25 54.57,20.97 U$14.2 U$14.3
  Top 0.305: IC1.10 IC1.9 | C1.2 18.46,28.62
  Top 0.6: 51.1,28.01 R7.1
  Bottom 0.2: J7.9 16.66,38.7 14.12,38.7 J7.6
  other vias: 30.55,31.4 32.6,23.85 20.75,31.25 26.6,28.7 24.5,34.5 15.85,21.75 13.8,17.8 41.05,30.55 35.45,14.4 36.05,20.8 5.3,22 8.4,29.3 8.35,30.4 14.45,26.9 46.15,26.65 46.15,27.6 57.05,26.05 59.05,27.8 17.55,35.2
  pour Bottom (isolate 0.254): -0.5,11.5 -0.5,42.5 65.5,42.5 65.5,11.5 44.5,11.5 44.5,-0.55 27.6,-0.55 27.6,11.5
  pour Top: -0.3,42.3 65.3,42.3 65.3,11.7 44.2,11.85 44.2,-0.15 27.9,-0.15 27.9,11.7 -0.3,11.7
GPIO4  (via drill 0.35)
  Top 0.2: J7.7 13.67,35.75 11.78,35.75 11.78,30.07 8.1,26.39 v8.1,26.35 8.1,26.25
  Bottom 0.2: v8.1,26.35 3.12,26.35 J2.5 | R13.1 13.15,35.23 J7.7
  other vias: 13.15,34.25
GPIO12
  Top 0.2: R6.2 61.85,24.2 J10.2
  Bottom 0.2: J7.32 47.15,38.69 51.44,38.69 52.17,37.96 52.17,36.94 50.54,35.3 50.54,34.07 60.66,23.95 J10.2
GPIO13  (via drill 0.35)
  Top 0.2: U$11.3 43.56,7.16 43.56,12.83 41.9,14.49 41.9,21.2 v42,21.1 | R11.2 45.64,34.7 J7.33
  Bottom 0.2: v42,21.1 42,26.74 41.77,26.97 41.77,30.83 J7.33
GPIO16
  Top 0.2: R8.2 59.7,22.45 J10.3
  Bottom 0.2: J10.3 62.1,22.67 63.41,23.98 63.41,34.39 62.59,35.21 60.01,35.21 56.52,38.69 55.34,38.69 54.71,39.32 54.71,40.5 53.98,41.23 52.96,41.23 51.72,39.99 J7.36
GPIO17  (via drill 0.35)
  Top 0.2: J8.3 21.45,15.8 R4.1 22.25,16.9 24.27,16.9 25.5,18.13 v25.5,24.95
  Bottom 0.2: J7.11 20.45,35.81 25.4,30.86 25.4,25.05 v25.5,24.95
GPIO18  (via drill 0.35)
  Top 0.2: J7.12 19.15,38.69 17.4,38.69 16.67,37.96 16.67,36.21 16.16,35.7 14.19,35.7 13.84,35.35 12.18,35.35 12.18,32.4 | 12.18,32.4 12.18,29.47 8.3,25.59 v8.3,25.35 8.3,25.2 | R14.1 13.1,32.4 12.18,32.4
  Bottom 0.2: v8.3,25.35 8.05,25.35 7.45,25.95 3.65,25.95 2.71,25.01 2.71,24.5 1.87,23.66 J2.4
GPIO19  (via drill 0.35)
  Top 0.2: v38.1,20.75 38.05,20.75 38.05,15.33 36.05,13.33 36.05,4.65 U$11.1 | R12.1 46.28,32.8 J7.35
  Bottom 0.2: v38.1,20.75 40.24,20.75 40.57,20.42 42.78,20.42 42.78,29.93 50.3,37.45 J7.35
GPIO20
  Top 0.2: R23.1 58.4,29.3 J4.4
  Top 0.25: 58.65,29.05 R23.1
  Bottom 0.2: J7.38 54.77,38.69 54.77,36.72 56.97,34.52 61.19,34.52 61.48,34.8 62.42,34.8 63,34.22 63,30.15 62.15,29.3 J4.4
GPIO21
  Top 0.2: R9.2 60.1,20.95 J10.4
  Bottom 0.2: J7.40 60.39,35.61 62.76,35.61 63.81,34.56 63.81,22.88 62.1,21.17 J10.4
GPIO25
  Top 0.2: J3.4 34.39,36.5 34.39,37.96 33.15,39.2 J7.22
GPIO26
  Top 0.2: R24.2 59.65,31.45 J4.1
  Top 0.25: R24.2
  Bottom 0.2: J7.37 57.12,33.8 J4.1
GPIO27  (via drill 0.35)
  Top 0.2: v26.46,25 26.18,24.72 26.18,18.24 24.44,16.5 24.2,16.5 23.45,15.75 23.45,15.9 R5.2 25.45,13.9 J8.1
  Bottom 0.2: J7.13 22.99,33.86 25.92,30.93 25.92,25.5 26.18,25.23 26.18,25.17 26.3,25.05 26.41,25.05 v26.46,25
HTR_NEG
  Top 0.5: 4.75,29.9 U$5.5 3.88,29.7 2.1,31.48 1.71,31.48 J9.4
N$3
  Top 0.2: U$6.1 U$6.2
  Top 0.4: MPOWER.1 45.35,18.73 U$6.2 U$6.3 | 45.35,18.24 45.35,18.7 45.33,18.73 U$6.1
N$4
  Top 0.305: IC1.2 11.5,16.07 IC1.1
  Top 0.6: J6.4 10.58,15.15 11.5,16.07
  Top 0.8: 10.68,13.65 J6.4
N$6
  Top 0.305: IC1.6 14.3,16.07 IC1.5
  Top 0.6: J6.3 13.12,14.5 13.17,14.5 14.16,15.49 14.16,15.94 14.3,16.07
N$7
  Top 0.305: IC1.8 15.5,16.07 IC1.7
  Top 0.6: J6.2 15.66,15.91 15.5,16.07
N$9
  Top 0.305: IC1.12 18.15,16.07 IC1.11
  Top 0.6: J6.1 18.2,16.02 18.15,16.07
N$10  (via drill 0.5)
  Top 0.2: R15.2 47.98,18.73 U$6.4
  Top 0.4: v48.52,15.93 49,16.41 R15.2
  Bottom 0.4: J5.1 53.05,13.65 51.91,12.51 50.41,12.51 49.82,13.1 49.82,14.63 v48.52,15.93 48.75,15.7
N$12
  Top 0.4: J1.1 28.12,16.98 IC3.1 IC3.2
N$14
  Top 0.4: J1.2 30.34,17.03 30.73,17.41 IC3.5 IC3.6
  Top 0.5: 30.39,16.7 J1.2
N$15
  Top 0.4: J1.3 32.88,17.31 32.73,17.46 32.73,18.4 IC3.8 IC3.7
N$16
  Top 0.25: R1.2 51.95,23 55.9,23 55.9,23.99 U$14.5
N$17
  Top 0.4: J1.4 35.42,17.18 35.27,17.32 IC3.12 IC3.11
N$20  (via drill 0.35, 0.5)
  Top 0.2: 51.35,18.85 51.35,20.5 R1.1 | U$15.4 5.25,17.7 C15.2 9.05,15.7 v9.4,15.7
  Top 0.25: 51.35,18.85 50.7,18.2 v50.45,18.2
  Bottom 0.2: v50.45,18.2 45.55,18.2 45.05,18.7 42.55,18.7 42.05,18.2 27.25,18.2 25.05,16 9.7,16 v9.4,15.7
N$133
  Top 0.2: LED1.C 52.94,26.11 R7.2
  Top 0.4: 53.24,27.67 R7.2
PWM0  (via drill 0.35)
  Top 0.2: v10.55,30.85 10.35,30.85 9.25,31.95 7.2,31.95 | 7.2,31.95 R10.2 | v24.7,30.05 27.81,30.05 U2.6 | U$5.4 7.17,31.93 7.2,31.95
  Bottom 0.2: v10.55,30.85 10.95,30.45 22.1,30.45 22.1,30.05 v24.7,30.05
PWM2
  Top 0.2: U2.8 28.3,31.36 28.77,30.89 IC3.23
PWM3
  Top 0.2: U2.9 28.27,32.01 29.43,30.86 IC3.22
PWM4
  Top 0.2: U2.10 28.29,32.66 30.07,30.88 IC3.21
PWM5
  Top 0.2: U2.11 29.8,33.31 32.67,30.44 IC3.17
PWM6
  Top 0.2: U2.12 29.71,33.96 33.32,30.36 33.32,26.1 33.33,26.09 IC3.16
PWM7
  Top 0.2: U2.13 29.63,34.61 33.97,30.28 33.97,26 33.98,26 IC3.15
PWM8
  Top 0.2: U2.15 21.43,35.26 20.34,34.16 18.61,34.16 11.91,27.46 IC1.23
  Top 0.305: U2.15 21.93,35.21
PWM9
  Top 0.2: U2.16 21.38,34.61 20.48,33.71 18.73,33.71 12.56,27.55 IC1.22
  Top 0.305: 12.6,23.36 IC1.22
PWM10
  Top 0.2: U2.17 21.33,33.96 20.64,33.26 18.85,33.26 13.21,27.62 IC1.21
  Top 0.305: 13.29,23.4 IC1.21
PWM11
  Top 0.2: U2.18 21.33,33.31 20.84,32.81 19.11,32.81 15.81,29.51 IC1.17
PWM12
  Top 0.2: U2.19 21.28,32.66 20.98,32.36 19.23,32.36 16.46,29.59 IC1.16
PWM13
  Top 0.2: U2.20 21.9,31.93 19.37,31.93 17.11,29.67 IC1.15
RXD
  Bottom 0.2: J3.2 36.93,36.5 36.93,40.61 35.95,41.59 19.51,41.59 J7.10
SCL  (via drill 0.35)
  Top 0.2: J7.5 11.35,35.97 | U2.26 23.21,28.11 v23.25,28.15 | v10.55,29.8 10.55,29.5 8.7,27.65 v4,27.65 | J2.6 3.75,24.15 U$15.10
  Top 0.25: 11.35,35.97 11.35,30.6 v10.55,29.8
  Bottom 0.2: v23.25,28.15 21.4,30 10.75,30 v10.55,29.8 | J2.6 3.15,27.65 v4,27.65
SDA  (via drill 0.35, 0.5 pad 1)
  Top 0.2: v10.5,31.95 10.5,37.24 J7.3 | U2.27 22.03,27.41 23.04,27.41 v23.3,27.15 | J2.3 3.69,22.39 4.25,22.95 U$15.9
  Bottom 0.2: v10.5,31.95 9.85,31.3 9.85,29.13 10.54,28.44 11.21,28.44 12.37,29.6 20.75,29.6 23.03,27.32 23.13,27.32 v23.3,27.15 | J7.3 9.05,38.69 6.89,38.69 4.8,36.6 0.55,36.6 0.55,23.2 1.36,22.39 J2.3
THERM
  Top 0.2: R22.1 3.93,26.62 | J9.5 3.25,28.67 3.25,27.2 4.4,26.05 R22.1 | R22.1 5.75,24.8 U$15.6
TXD
  Bottom 0.2: J3.3 36.16,36 34.43,36 34.43,38.07 33.75,38.75 17.32,38.75 16.08,39.99 J7.8

### Text on the board
tNames: 40 | 2 | 1 | 39 | - | + | PWR SW
bNames: CameraDolly v3 / (c) UnfinishedHacks.net / 2020